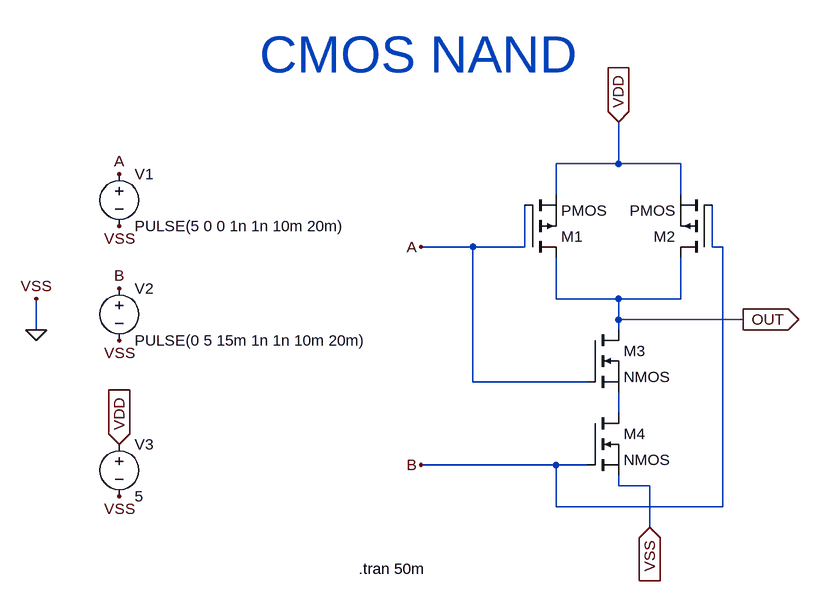
[diagram p0: schematic CMOS NAND.asc]
CMOS NAND.asc, the LTspice schematic file:
Version 4.1
SHEET 1 880 680
WIRE 224 -80 224 -144
WIRE 224 -80 128 -80
WIRE 320 -80 224 -80
WIRE 128 -32 128 -80
WIRE 320 -32 320 -80
WIRE 0 48 -80 48
WIRE 80 48 80 -16
WIRE 80 48 0 48
WIRE 368 48 368 -16
WIRE 384 48 368 48
WIRE 128 128 128 64
WIRE 224 128 128 128
WIRE 320 128 320 64
WIRE 320 128 224 128
WIRE 224 160 224 128
WIRE 416 160 224 160
WIRE -672 176 -672 128
WIRE 224 176 224 160
WIRE 0 256 0 48
WIRE 176 256 0 256
WIRE 224 304 224 272
WIRE 128 384 -80 384
WIRE 176 384 128 384
WIRE 224 416 224 400
WIRE 272 416 224 416
WIRE 128 448 128 384
WIRE 384 448 384 48
WIRE 384 448 128 448
WIRE 272 480 272 416
FLAG -80 48 A
FLAG -80 384 B
FLAG 416 160 OUT
IOPIN 416 160 Out
FLAG 224 -144 VDD
IOPIN 224 -144 In
FLAG 272 480 VSS
IOPIN 272 480 In
FLAG -544 352 VDD
IOPIN -544 352 In
FLAG -544 -64 A
FLAG -544 112 B
FLAG -672 176 0
FLAG -672 128 VSS
FLAG -544 432 VSS
FLAG -544 192 VSS
FLAG -544 16 VSS
SYMBOL pmos 80 64 M180
SYMATTR InstName M1
SYMBOL pmos 368 64 R180
SYMATTR InstName M2
SYMBOL nmos 176 176 R0
SYMATTR InstName M3
SYMBOL nmos 176 304 R0
SYMATTR InstName M4
SYMBOL voltage -544 -80 R0
SYMATTR InstName V1
SYMATTR Value PULSE(5 0 0 1n 1n 10m 20m)
SYMBOL voltage -544 96 R0
SYMATTR InstName V2
SYMATTR Value PULSE(0 5 15m 1n 1n 10m 20m)
SYMBOL voltage -544 336 R0
SYMATTR InstName V3
SYMATTR Value 5
TEXT -176 544 Left 2 !.tran 50m
TEXT -328 -248 Left 6 ;CMOS NAND

The netlist it stands for:
* CMOS NAND.asc
M1 OUT A VDD VDD PMOS
M2 OUT B VDD VDD PMOS
M3 OUT A N001 N001 NMOS
M4 N001 B 0 0 NMOS
V1 A 0 PULSE(5 0 0 1n 1n 10m 20m)
V2 B 0 PULSE(0 5 15m 1n 1n 10m 20m)
V3 VDD 0 5
.model NMOS NMOS
.model PMOS PMOS
.lib standard.mos
.tran 50m
* CMOS NAND
.backanno
.end